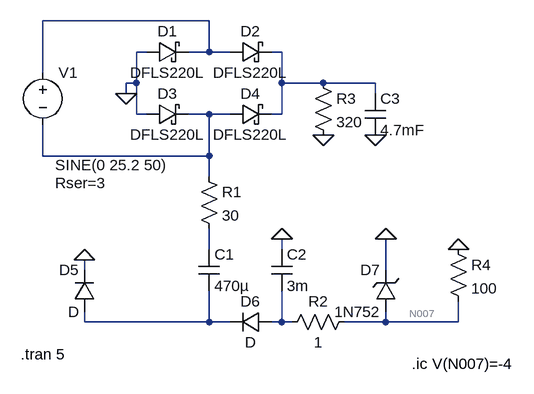
[diagram p0: schematic negative_rail.asc]
negative_rail.asc, the LTspice schematic file:
Version 4
SHEET 1 880 680
WIRE 192 48 -64 48
WIRE 96 96 80 96
WIRE 192 96 192 48
WIRE 192 96 160 96
WIRE 224 96 192 96
WIRE 304 96 288 96
WIRE -64 128 -64 48
WIRE 80 144 80 96
WIRE 80 144 64 144
WIRE 304 144 304 96
WIRE 368 144 304 144
WIRE 448 144 368 144
WIRE 64 160 64 144
WIRE 448 160 448 144
WIRE 80 192 80 144
WIRE 96 192 80 192
WIRE 192 192 160 192
WIRE 224 192 192 192
WIRE 304 192 304 144
WIRE 304 192 288 192
WIRE -64 256 -64 208
WIRE 192 256 192 192
WIRE 192 256 -64 256
WIRE 192 288 192 256
WIRE 192 400 192 368
WIRE 304 400 304 384
WIRE 0 432 0 416
WIRE 464 432 464 384
WIRE 0 512 0 496
WIRE 192 512 192 464
WIRE 192 512 0 512
WIRE 224 512 192 512
WIRE 304 512 304 464
WIRE 304 512 288 512
WIRE 320 512 304 512
WIRE 464 512 464 496
WIRE 464 512 400 512
WIRE 576 512 576 480
WIRE 576 512 464 512
FLAG 64 160 0
FLAG 0 416 0
FLAG 304 384 0
FLAG 464 384 0
FLAG 368 224 0
FLAG 448 224 0
FLAG 576 400 0
SYMBOL voltage -64 112 R0
WINDOW 3 19 158 Left 2
WINDOW 123 0 0 Left 2
WINDOW 39 19 186 Left 2
SYMATTR InstName V1
SYMATTR Value SINE(0 25.2 50)
SYMATTR SpiceLine Rser=3
SYMBOL schottky 224 112 R270
WINDOW 0 32 32 VTop 2
WINDOW 3 0 32 VBottom 2
SYMATTR InstName D2
SYMATTR Value DFLS220L
SYMATTR Description Diode
SYMATTR Type diode
SYMBOL res 176 272 R0
SYMATTR InstName R1
SYMATTR Value 30
SYMBOL cap 176 400 R0
SYMATTR InstName C1
SYMATTR Value 470µ
SYMBOL diode 16 496 R180
WINDOW 0 24 64 Left 2
WINDOW 3 24 0 Left 2
SYMATTR InstName D5
SYMBOL diode 288 496 R90
WINDOW 0 0 32 VBottom 2
WINDOW 3 32 32 VTop 2
SYMATTR InstName D6
SYMBOL cap 288 400 R0
SYMATTR InstName C2
SYMATTR Value 3m
SYMBOL res 416 496 R90
WINDOW 0 0 56 VBottom 2
WINDOW 3 32 56 VTop 2
SYMATTR InstName R2
SYMATTR Value 1
SYMBOL zener 480 496 R180
WINDOW 0 24 64 Left 2
WINDOW 3 24 0 Left 2
SYMATTR InstName D7
SYMATTR Value 1N752
SYMBOL res 352 128 R0
SYMATTR InstName R3
SYMATTR Value 320
SYMBOL cap 432 160 R0
SYMATTR InstName C3
SYMATTR Value 4.7mF
SYMATTR SpiceLine Rser=0.5
SYMBOL res 560 384 R0
SYMATTR InstName R4
SYMATTR Value 100
SYMBOL schottky 96 112 R270
WINDOW 0 32 32 VTop 2
WINDOW 3 0 32 VBottom 2
SYMATTR InstName D1
SYMATTR Value DFLS220L
SYMATTR Description Diode
SYMATTR Type diode
SYMBOL schottky 96 208 R270
WINDOW 0 32 32 VTop 2
WINDOW 3 0 32 VBottom 2
SYMATTR InstName D3
SYMATTR Value DFLS220L
SYMATTR Description Diode
SYMATTR Type diode
SYMBOL schottky 224 208 R270
WINDOW 0 32 32 VTop 2
WINDOW 3 0 32 VBottom 2
SYMATTR InstName D4
SYMATTR Value DFLS220L
SYMATTR Description Diode
SYMATTR Type diode
TEXT -98 562 Left 2 !.tran 5
TEXT 504 576 Left 2 !.ic V(N007)=-4

The netlist it stands for:
* negative_rail.asc
V1 N001 N003 SINE(0 25.2 50) Rser=3
D2 N001 N002 DFLS220L
R1 N003 N004 30
C1 N004 N005 470µ
D5 N005 0 D
D6 N006 N005 D
C2 0 N006 3m
R2 N007 N006 1
D7 N007 0 1N752
R3 N002 0 320
C3 N002 0 4.7mF Rser=0.5
R4 0 N007 100
D1 0 N001 DFLS220L
D3 0 N003 DFLS220L
D4 N003 N002 DFLS220L
.model D D
.lib standard.dio
.tran 5
.ic V(N007)=-4
.backanno
.end